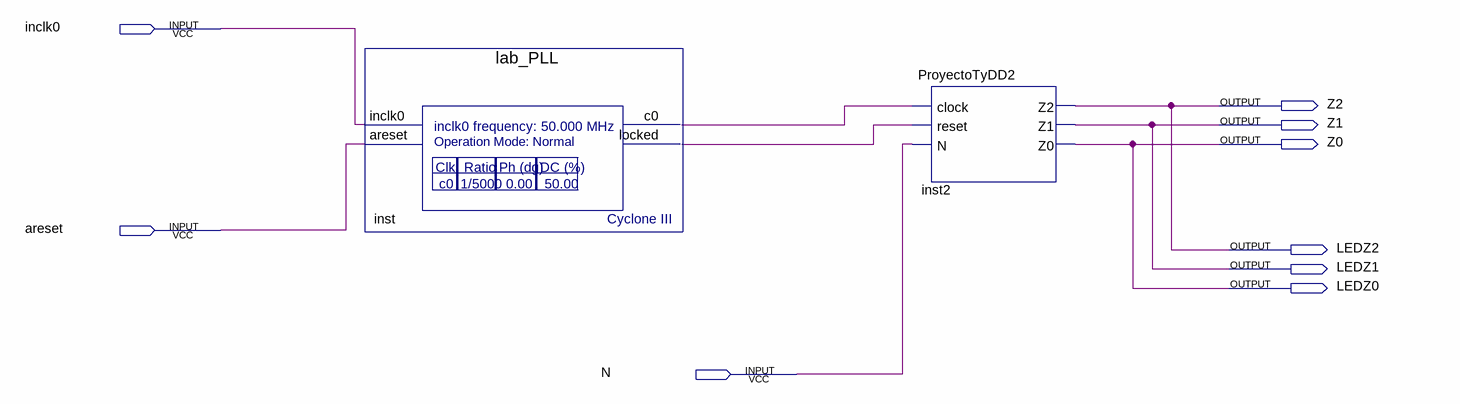
[diagram p0: schematic sheet]
// Quartus schematic Completo.bdf as structural Verilog: 2 symbols, 9 pins
module Completo (
  input  inclk0,
  input  areset,
  input  N,
  output Z2,
  output Z1,
  output Z0,
  output LEDZ2,
  output LEDZ1,
  output LEDZ0
);

  wire inst_c0, inst_locked;

  lab_PLL inst (.inclk0(inclk0), .areset(areset), .c0(inst_c0), .locked(inst_locked));
  ProyectoTyDD2 inst2 (.clock(inst_c0), .reset(inst_locked), .N(N), .Z2(LEDZ2), .Z1(LEDZ1), .Z0(LEDZ0));

  assign Z0 = LEDZ0;
  assign Z1 = LEDZ1;
  assign Z2 = LEDZ2;
endmodule
